# EAGLE design mbedWarp (EAGLE 7.7.0)

## Sheet 1 of 4
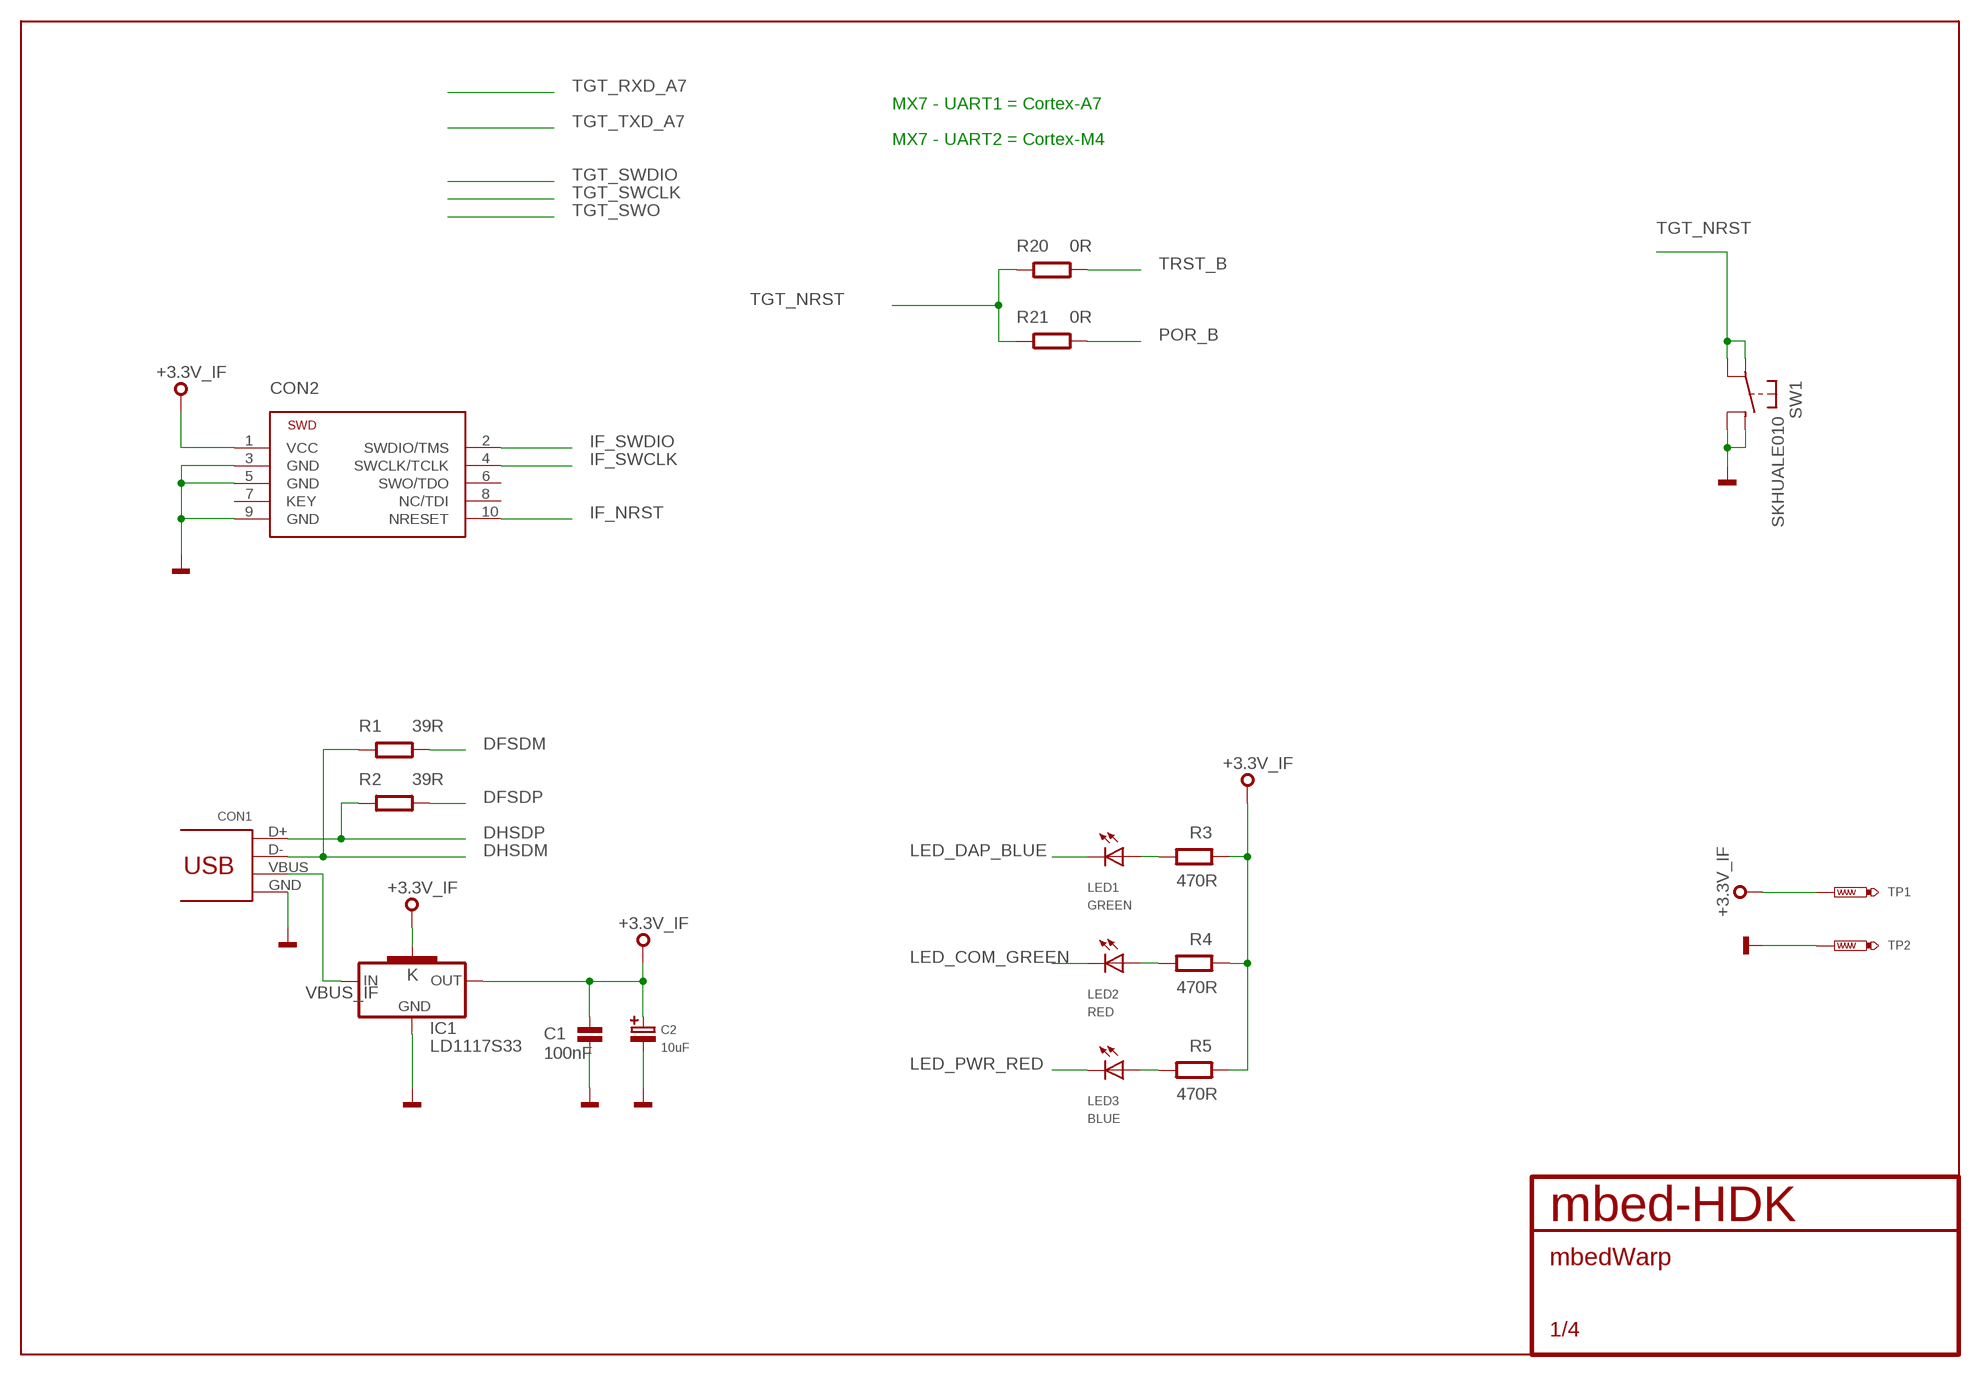
[diagram p0: schematic, sheet 1]

### Parts
C1  100nF  C0603  [0603]
C2  10uF  C-POL_B  [CASE-B]
CON1  USB_MICROB  [MOLEX-47364-0001]
CON2  SWD-10-SMD  [SWD-10-SMD]
IC1  LD1117S33  [SOT223]
LED1  GREEN  LED0603  [CHIPLED_0603]
LED2  RED  LED0603  [CHIPLED_0603]
LED3  BLUE  LED0603  [CHIPLED_0603]
R1  39R  R0603  [0603]
R2  39R  R0603  [0603]
R3  470R  R0603  [0603]
R4  470R  R0603  [0603]
R5  470R  R0603  [0603]
R20  0R  R0603  [0603]
R21  0R  R0603  [0603]
SW1  SKHUALE010  [SKHUALE010]
TP1  TEST-POINT-50R-PTH  [TP50-PTH]
TP2  TEST-POINT-50R-PTH  [TP50-PTH]

### Nets
+3.3V_IF: C1.1 C2.1 CON2.1(VCC) IC1.2(OUT) IC1.4(K) R3.1 R4.1 R5.1 TP1.TP ; also sheet 2,3,4
DFSDM: R1.2 ; also sheet 2
DFSDP: R2.2 ; also sheet 2
DHSDM: CON1.D- R1.1 ; also sheet 2
DHSDP: CON1.D+ R2.1 ; also sheet 2
GND: C1.2 C2.2 CON1.GND CON2.3(GND) CON2.5(GND) CON2.9(GND) IC1.1(GND) SW1.P$3(B1) SW1.P$4(B2) TP2.TP ; also sheet 2,3,4
IF_NRST: CON2.10(NRESET) ; also sheet 2
IF_SWCLK: CON2.4(SWCLK/TCLK) ; also sheet 2
IF_SWDIO: CON2.2(SWDIO/TMS) ; also sheet 2
LED_COM_GREEN: LED2.C ; also sheet 2
LED_DAP_BLUE: LED1.C ; also sheet 2
LED_PWR_RED: LED3.C ; also sheet 2
N$6: LED2.A R4.2
N$9: LED1.A R3.2
N$13: LED3.A R5.2
POR_B: R21.2 ; also sheet 4
TGT_NRST: R20.1 R21.1 SW1.P$1(A1) SW1.P$2(A2) ; also sheet 2
TRST_B: R20.2 ; also sheet 4
VBUS_IF: CON1.VBUS IC1.3(IN)
Unconnected: CON2.6(SWO/TDO) CON2.7(KEY) CON2.8(NC/TDI)

### Notes on the sheet
- MX7 - UART1 = Cortex-A7
- MX7 - UART2 = Cortex-M4

## Sheet 2 of 4
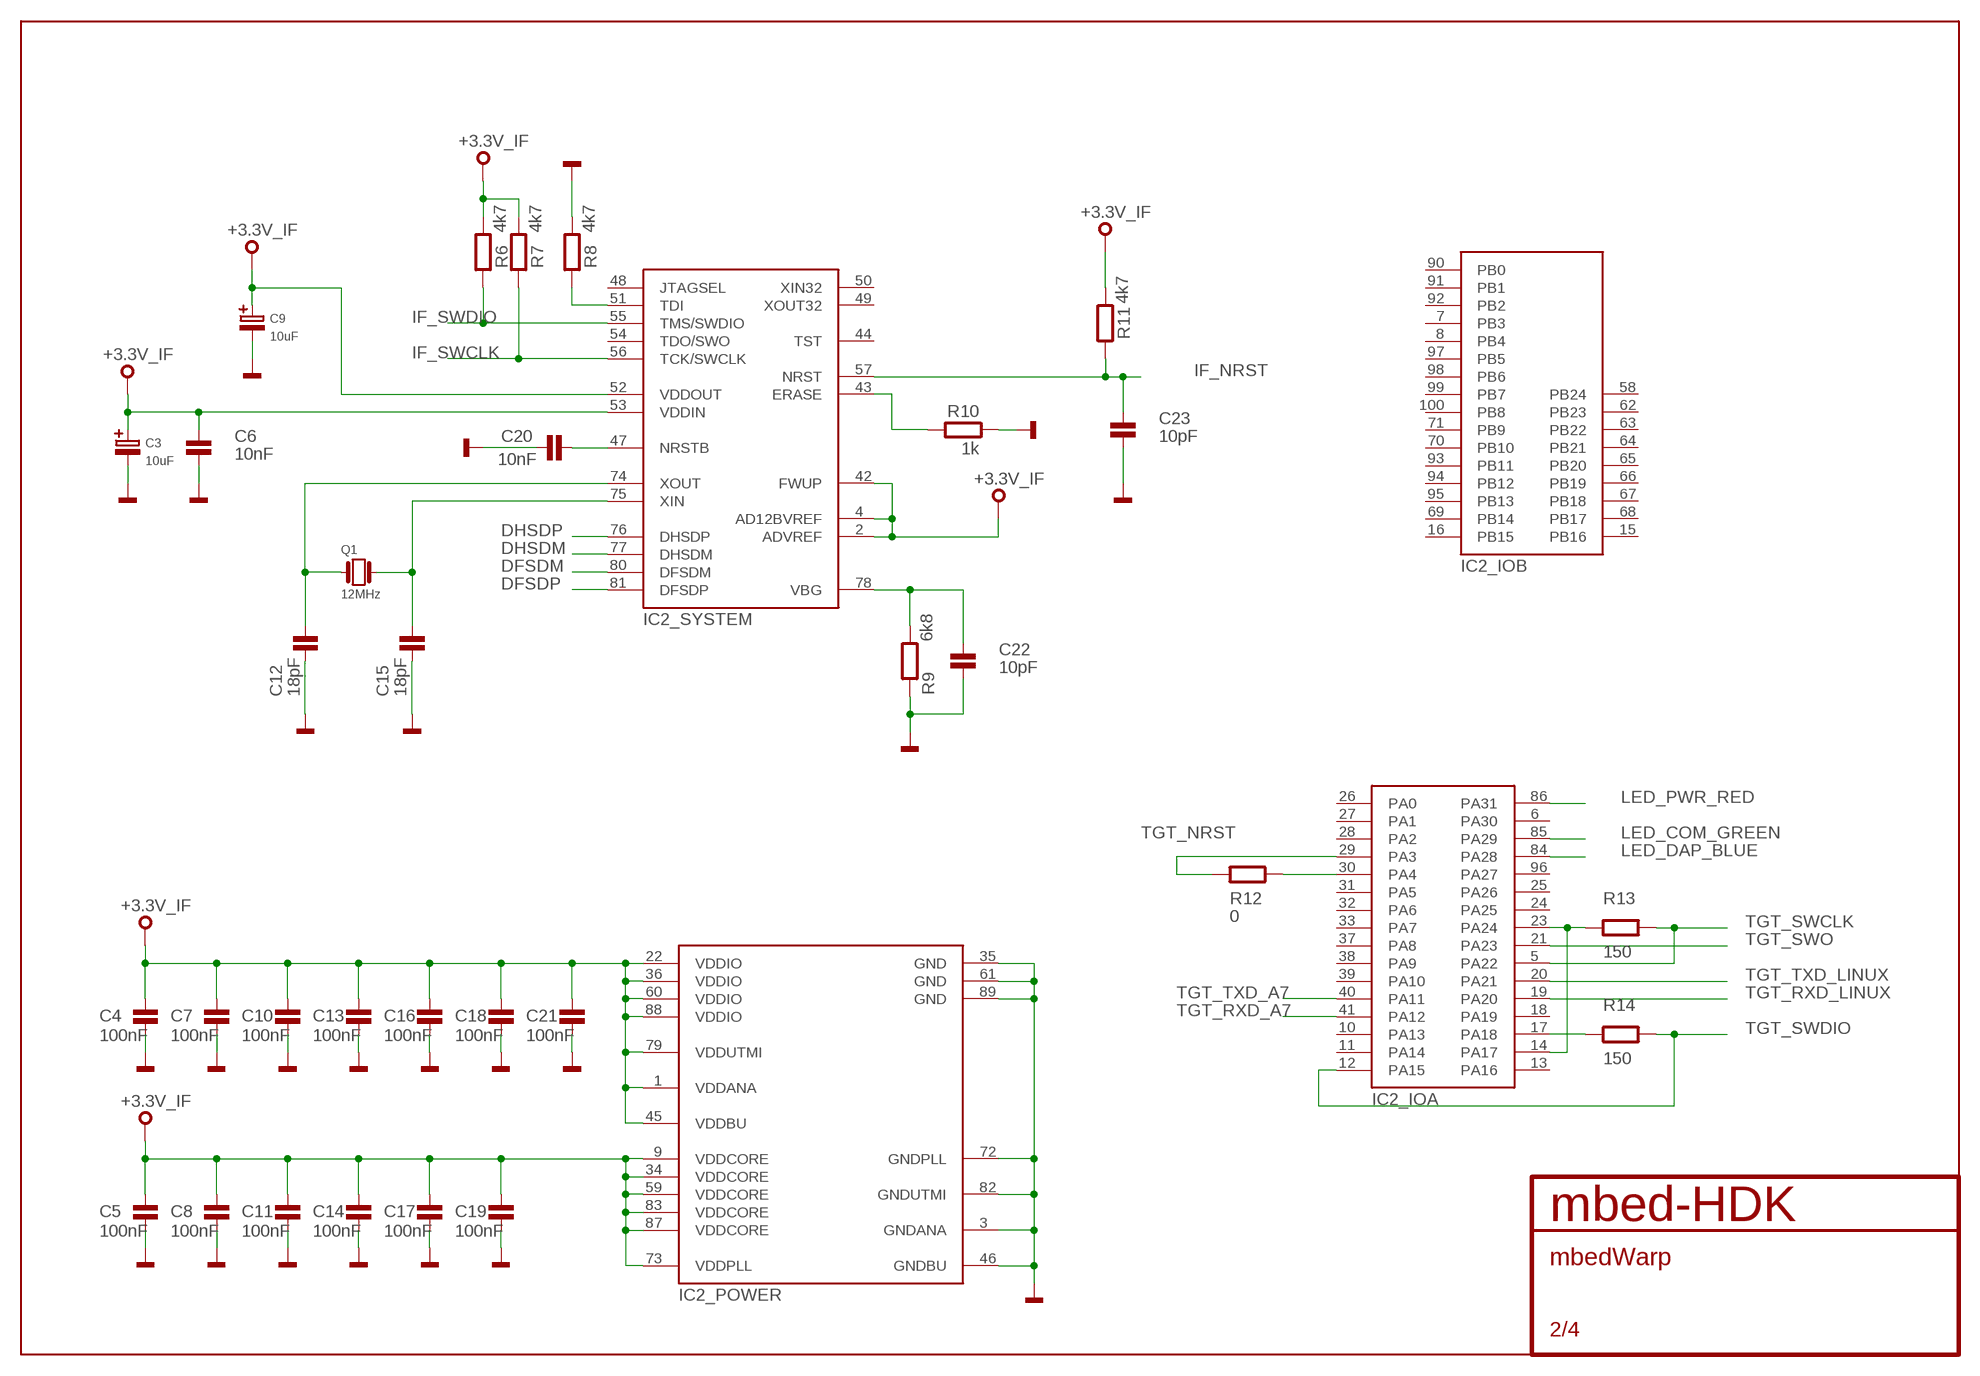
[diagram p1: schematic, sheet 2]

### Parts
C3  10uF  C-POL_B  [CASE-B]
C4  100nF  C0603  [0603]
C5  100nF  C0603  [0603]
C6  10nF  C0603  [0603]
C7  100nF  C0603  [0603]
C8  100nF  C0603  [0603]
C9  10uF  C-POL_B  [CASE-B]
C10  100nF  C0603  [0603]
C11  100nF  C0603  [0603]
C12  18pF  C0603  [0603]
C13  100nF  C0603  [0603]
C14  100nF  C0603  [0603]
C15  18pF  C0603  [0603]
C16  100nF  C0603  [0603]
C17  100nF  C0603  [0603]
C18  100nF  C0603  [0603]
C19  100nF  C0603  [0603]
C20  10nF  C0603  [0603]
C21  100nF  C0603  [0603]
C22  10pF  C0603  [0603]
C23  10pF  C0603  [0603]
IC2  AT91SAM3U2CA  [LQFP100]
Q1  12MHz  Q_3.2X2.5  [3.2X.2.5]
R6  4k7  R0603  [0603]
R7  4k7  R0603  [0603]
R8  4k7  R0603  [0603]
R9  6k8  R0603  [0603]
R10  1k  R0603  [0603]
R11  4k7  R0603  [0603]
R12  0  R0603  [0603]
R13  150  R0603  [0603]
R14  150  R0603  [0603]

### Nets
+3.3V_IF: C3.1 C4.1 C5.1 C6.1 C7.1 C8.1 C9.1 C10.1 C11.1 C13.1 C14.1 C16.1 C17.1 C18.1 C19.1 C21.1 IC2.1(_POWER:VDDANA) IC2.2(_SYSTEM:ADVREF) IC2.4(_SYSTEM:AD12BVREF) IC2.9(_POWER:VDDCORE) IC2.22(_POWER:VDDIO) IC2.34(_POWER:VDDCORE) IC2.36(_POWER:VDDIO) IC2.42(_SYSTEM:FWUP) IC2.45(_POWER:VDDBU) IC2.52(_SYSTEM:VDDOUT) IC2.53(_SYSTEM:VDDIN) IC2.59(_POWER:VDDCORE) IC2.60(_POWER:VDDIO) IC2.73(_POWER:VDDPLL) IC2.79(_POWER:VDDUTMI) IC2.83(_POWER:VDDCORE) IC2.87(_POWER:VDDCORE) IC2.88(_POWER:VDDIO) R6.2 R7.2 R11.2 ; also sheet 1,3,4
DFSDM: IC2.80(_SYSTEM:DFSDM) ; also sheet 1
DFSDP: IC2.81(_SYSTEM:DFSDP) ; also sheet 1
DHSDM: IC2.77(_SYSTEM:DHSDM) ; also sheet 1
DHSDP: IC2.76(_SYSTEM:DHSDP) ; also sheet 1
GND: C3.2 C4.2 C5.2 C6.2 C7.2 C8.2 C9.2 C10.2 C11.2 C12.2 C13.2 C14.2 C15.2 C16.2 C17.2 C18.2 C19.2 C20.2 C21.2 C22.2 C23.2 IC2.3(_POWER:GNDANA) IC2.35(_POWER:GND) IC2.46(_POWER:GNDBU) IC2.61(_POWER:GND) IC2.72(_POWER:GNDPLL) IC2.82(_POWER:GNDUTMI) IC2.89(_POWER:GND) R8.2 R9.1 R10.1 ; also sheet 1,3,4
IF_NRST: C23.1 IC2.57(_SYSTEM:NRST) R11.1 ; also sheet 1
IF_SWCLK: IC2.56(_SYSTEM:TCK/SWCLK) R7.1 ; also sheet 1
IF_SWDIO: IC2.55(_SYSTEM:TMS/SWDIO) R6.1 ; also sheet 1
LED_COM_GREEN: IC2.85(_IOA:PA29) ; also sheet 1
LED_DAP_BLUE: IC2.84(_IOA:PA28) ; also sheet 1
LED_PWR_RED: IC2.86(_IOA:PA31) ; also sheet 1
N$1: C12.1 IC2.74(_SYSTEM:XOUT) Q1.P$1
N$2: C15.1 IC2.75(_SYSTEM:XIN) Q1.P$3
N$3: C20.1 IC2.47(_SYSTEM:NRSTB)
N$4: IC2.51(_SYSTEM:TDI) R8.1
N$5: IC2.43(_SYSTEM:ERASE) R10.2
N$8: C22.1 IC2.78(_SYSTEM:VBG) R9.2
N$11: IC2.14(_IOA:PA17) IC2.23(_IOA:PA24) R13.1
N$12: IC2.17(_IOA:PA18) R14.1
N$14: IC2.30(_IOA:PA4) R12.2
TGT_NRST: IC2.29(_IOA:PA3) R12.1 ; also sheet 1
TGT_RXD_A7: IC2.41(_IOA:PA12) ; also sheet 1,4
TGT_RXD_LINUX: IC2.19(_IOA:PA20) ; also sheet 4
TGT_SWCLK: IC2.5(_IOA:PA22) R13.2 ; also sheet 1,4
TGT_SWDIO: IC2.12(_IOA:PA15) R14.2 ; also sheet 1,4
TGT_SWO: IC2.21(_IOA:PA23) ; also sheet 1,4
TGT_TXD_A7: IC2.40(_IOA:PA11) ; also sheet 1,4
TGT_TXD_LINUX: IC2.20(_IOA:PA21) ; also sheet 4
Unconnected: IC2.6(_IOA:PA30) IC2.7(_IOB:PB3) IC2.8(_IOB:PB4) IC2.10(_IOA:PA13) IC2.11(_IOA:PA14) IC2.13(_IOA:PA16) IC2.15(_IOB:PB16) IC2.16(_IOB:PB15) IC2.18(_IOA:PA19) IC2.24(_IOA:PA25) IC2.25(_IOA:PA26) IC2.26(_IOA:PA0) IC2.27(_IOA:PA1) IC2.28(_IOA:PA2) IC2.31(_IOA:PA5) IC2.32(_IOA:PA6) IC2.33(_IOA:PA7) IC2.37(_IOA:PA8) IC2.38(_IOA:PA9) IC2.39(_IOA:PA10) IC2.44(_SYSTEM:TST) IC2.48(_SYSTEM:JTAGSEL) IC2.49(_SYSTEM:XOUT32) IC2.50(_SYSTEM:XIN32) IC2.54(_SYSTEM:TDO/SWO) IC2.58(_IOB:PB24) IC2.62(_IOB:PB23) IC2.63(_IOB:PB22) IC2.64(_IOB:PB21) IC2.65(_IOB:PB20) IC2.66(_IOB:PB19) IC2.67(_IOB:PB18) IC2.68(_IOB:PB17) IC2.69(_IOB:PB14) IC2.70(_IOB:PB10) IC2.71(_IOB:PB9) IC2.90(_IOB:PB0) IC2.91(_IOB:PB1) IC2.92(_IOB:PB2) IC2.93(_IOB:PB11) IC2.94(_IOB:PB12) IC2.95(_IOB:PB13) IC2.96(_IOA:PA27) IC2.97(_IOB:PB5) IC2.98(_IOB:PB6) IC2.99(_IOB:PB7) IC2.100(_IOB:PB8)

## Sheet 3 of 4
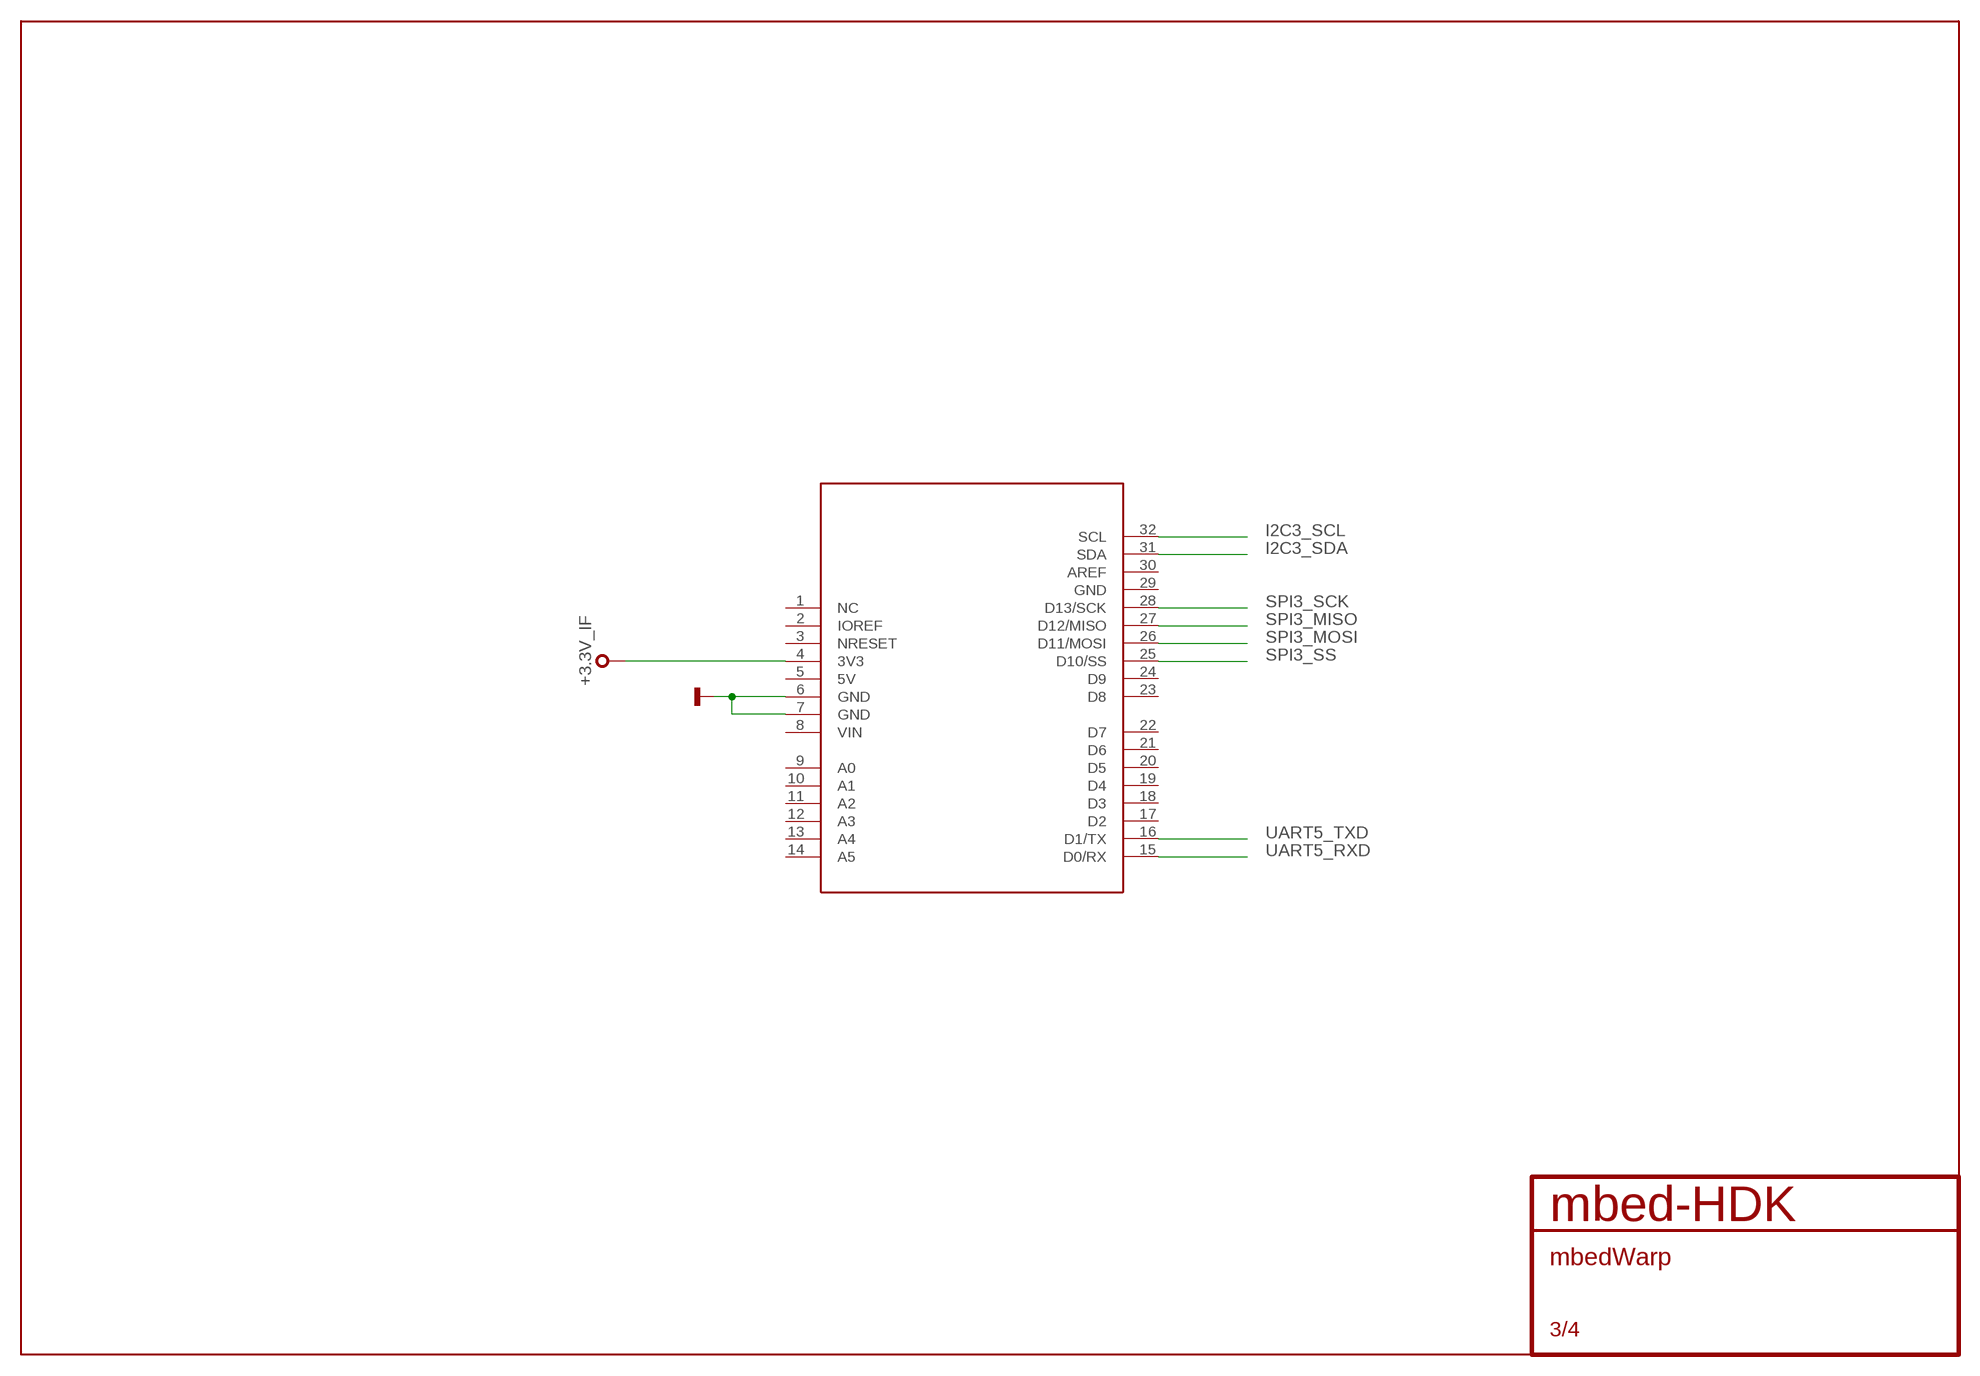
[diagram p2: schematic, sheet 3]

### Parts
BRD1  ARDUINO-R3_SILK  [ARDUINO-R3-SILK]

### Nets
+3.3V_IF: BRD1.4(3V3) ; also sheet 1,2,4
GND: BRD1.6(GND) BRD1.7(GND) ; also sheet 1,2,4
I2C3_SCL: BRD1.32(SCL) ; also sheet 4
I2C3_SDA: BRD1.31(SDA) ; also sheet 4
SPI3_MISO: BRD1.27(D12/MISO) ; also sheet 4
SPI3_MOSI: BRD1.26(D11/MOSI) ; also sheet 4
SPI3_SCK: BRD1.28(D13/SCK) ; also sheet 4
SPI3_SS: BRD1.25(D10/SS) ; also sheet 4
UART5_RXD: BRD1.15(D0/RX) ; also sheet 4
UART5_TXD: BRD1.16(D1/TX) ; also sheet 4
Unconnected: BRD1.1(NC) BRD1.2(IOREF) BRD1.3(NRESET) BRD1.5(5V) BRD1.8(VIN) BRD1.9(A0) BRD1.10(A1) BRD1.11(A2) BRD1.12(A3) BRD1.13(A4) BRD1.14(A5) BRD1.17(D2) BRD1.18(D3) BRD1.19(D4) BRD1.20(D5) BRD1.21(D6) BRD1.22(D7) BRD1.23(D8) BRD1.24(D9) BRD1.29(GND) BRD1.30(AREF)

## Sheet 4 of 4
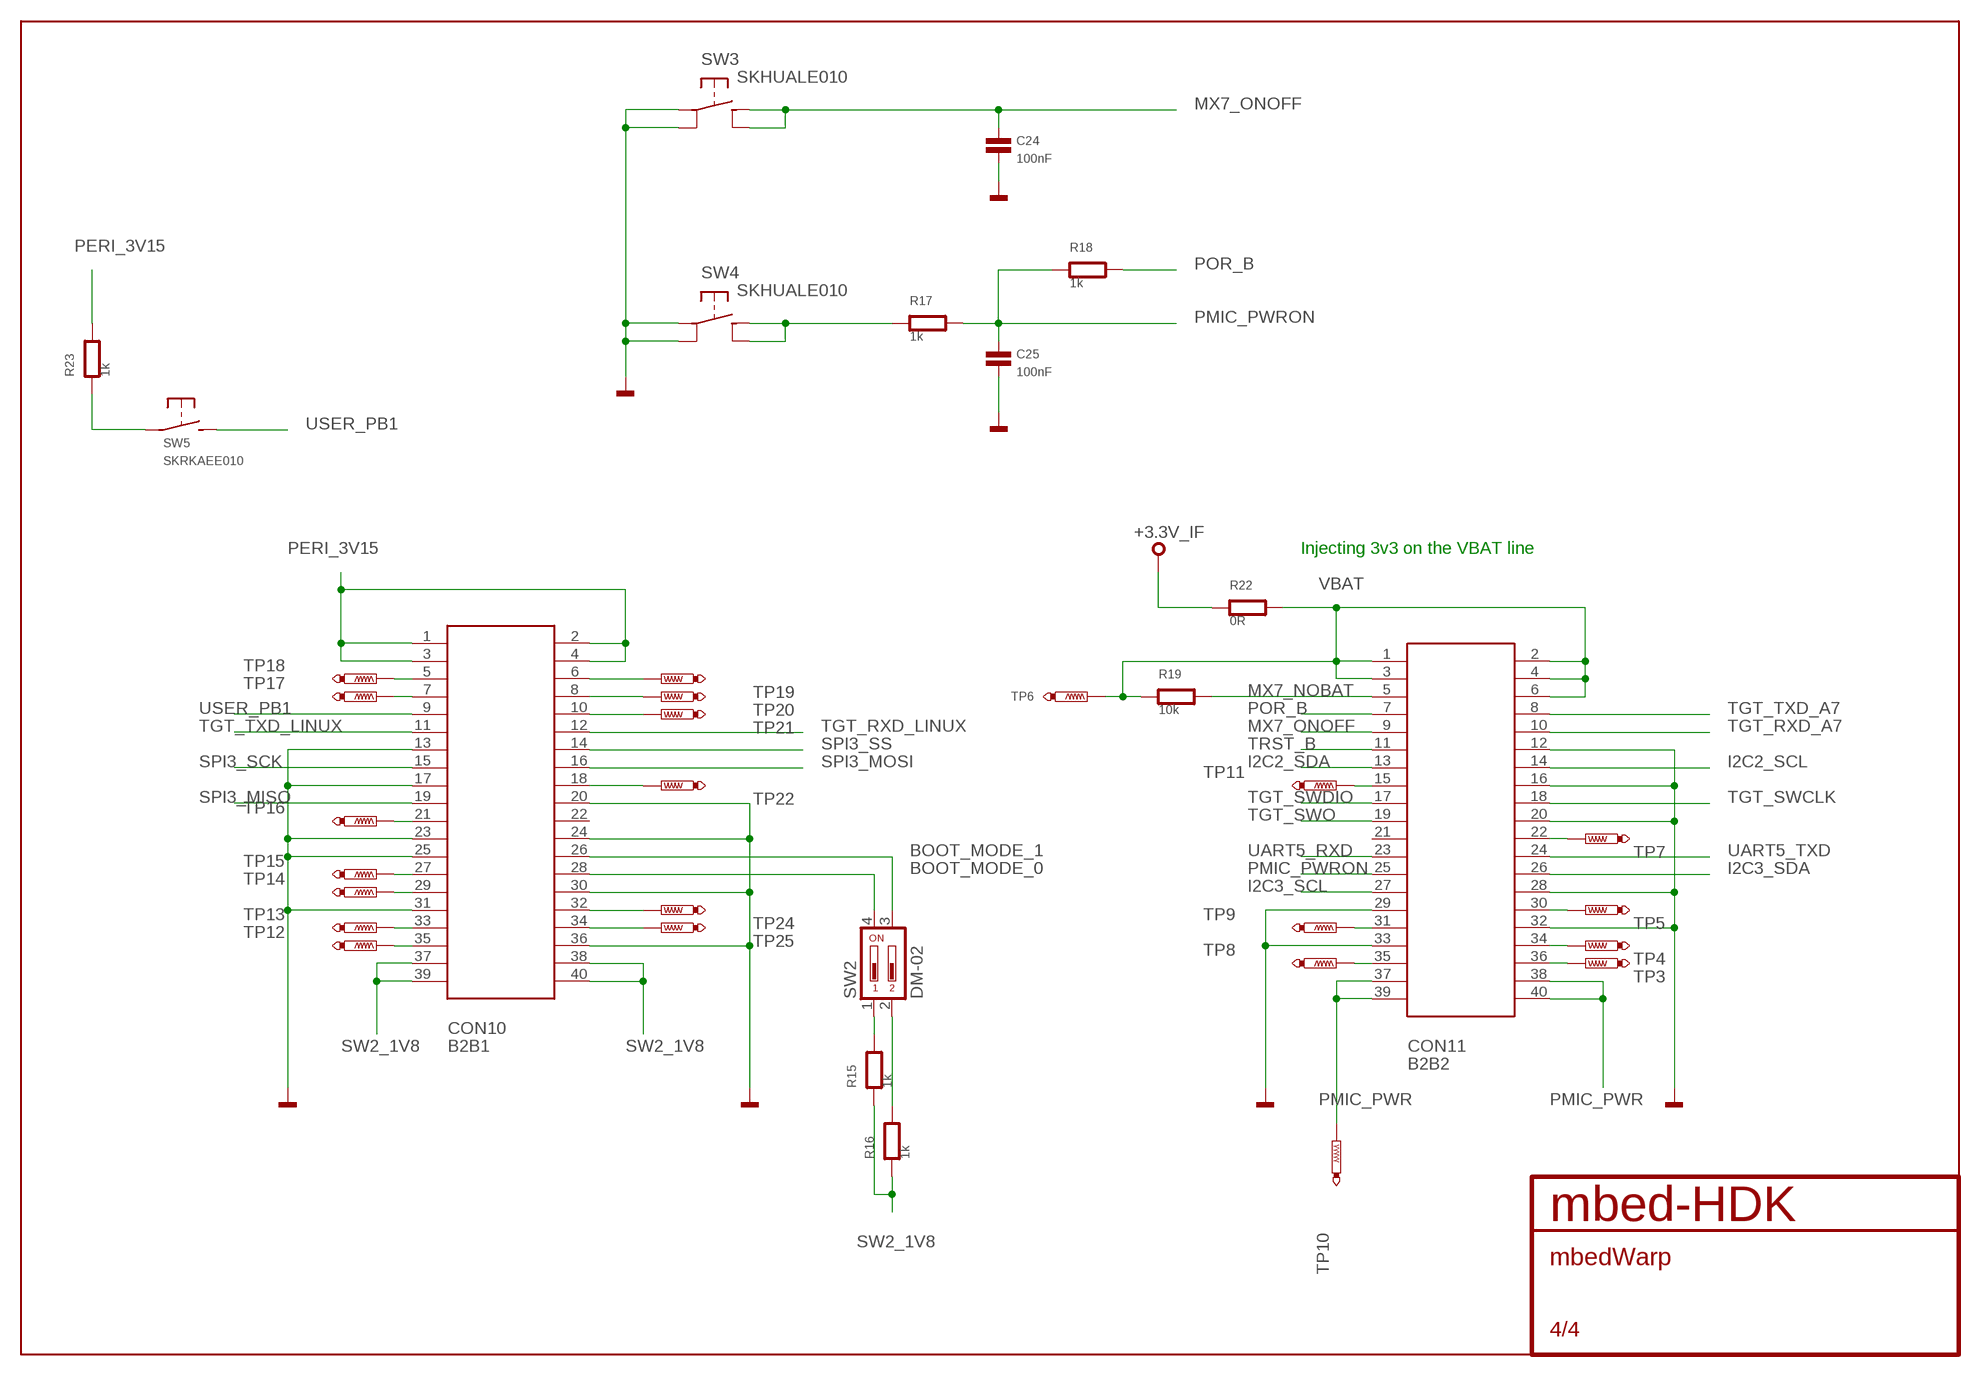
[diagram p3: schematic, sheet 4]

### Parts
C24  100nF  CAPACITOR0603  [0603]
C25  100nF  CAPACITOR0603  [0603]
CON10  B2B1  DF40HC-XX-40DS-XX-V  [DF40HC-XX-40DS-XX-V]
CON11  B2B2  DF40HC-XX-40DS-XX-V  [DF40HC-XX-40DS-XX-V]
R15  1k  RESISTOR0603  [0603]
R16  1k  RESISTOR0603  [0603]
R17  1k  RESISTOR0603  [0603]
R18  1k  RESISTOR0603  [0603]
R19  10k  RESISTOR0603  [0603]
R22  0R  RESISTOR0603  [0603]
R23  1k  RESISTOR0603  [0603]
SW2  DM-02  [DM-02]
SW3  SKHUALE010  [SKHUALE010]
SW4  SKHUALE010  [SKHUALE010]
SW5  SKRKAEE010  [SKRKAEE010]
TP3  PTR1TP06R  [TP06R]
TP4  PTR1TP06R  [TP06R]
TP5  PTR1TP06R  [TP06R]
TP6  TEST-POINT-50R-SMD  [TP50-SMD]
TP7  PTR1TP06R  [TP06R]
TP8  PTR1TP06R  [TP06R]
TP9  PTR1TP06R  [TP06R]
TP10  PTR1TP06R  [TP06R]
TP11  PTR1TP06R  [TP06R]
TP12  PTR1TP06R  [TP06R]
TP13  PTR1TP06R  [TP06R]
TP14  PTR1TP06R  [TP06R]
TP15  PTR1TP06R  [TP06R]
TP16  PTR1TP06R  [TP06R]
TP17  PTR1TP06R  [TP06R]
TP18  PTR1TP06R  [TP06R]
TP19  PTR1TP06R  [TP06R]
TP20  PTR1TP06R  [TP06R]
TP21  PTR1TP06R  [TP06R]
TP22  PTR1TP06R  [TP06R]
TP24  PTR1TP06R  [TP06R]
TP25  PTR1TP06R  [TP06R]

### Nets
+3.3V_IF: R22.1 ; also sheet 1,2,3
BOOT_MODE_0: CON10.28 SW2.4
BOOT_MODE_1: CON10.26 SW2.3
GND: C24.2 C25.2 CON10.13 CON10.17 CON10.20 CON10.23 CON10.24 CON10.25 CON10.30 CON10.31 CON10.36 CON11.12 CON11.16 CON11.20 CON11.28 CON11.29 CON11.32 CON11.33 SW3.P$1(A1) SW3.P$2(A2) SW4.P$1(A1) SW4.P$2(A2) ; also sheet 1,2,3
I2C2_SCL: CON11.14
I2C2_SDA: CON11.13
I2C3_SCL: CON11.27 ; also sheet 3
I2C3_SDA: CON11.26 ; also sheet 3
MX7_NOBAT: CON11.5 R19.2
MX7_ONOFF: C24.1 CON11.9 SW3.P$3(B1) SW3.P$4(B2)
N$7: R17.1 SW4.P$3(B1) SW4.P$4(B2)
N$10: R23.1 SW5.P$1(P)
N$15: CON11.36 TP3.TP
N$16: CON11.22 TP7.TP
N$17: CON11.30 TP5.TP
N$18: CON11.34 TP4.TP
N$19: CON11.15 TP11.TP
N$20: R15.2 SW2.1
N$21: R16.2 SW2.2
N$23: CON11.31 TP9.TP
N$24: CON11.35 TP8.TP
N$25: CON10.5 TP18.TP
N$26: CON10.7 TP17.TP
N$27: CON10.21 TP16.TP
N$28: CON10.27 TP15.TP
N$29: CON10.29 TP14.TP
N$30: CON10.33 TP13.TP
N$31: CON10.35 TP12.TP
N$32: CON10.34 TP25.TP
N$33: CON10.32 TP24.TP
N$35: CON10.18 TP22.TP
N$36: CON10.10 TP21.TP
N$37: CON10.8 TP20.TP
N$38: CON10.6 TP19.TP
PERI_3V15: CON10.1 CON10.2 CON10.3 CON10.4 R23.2
PMIC_PWR: CON11.37 CON11.38 CON11.39 CON11.40 TP10.TP
PMIC_PWRON: C25.1 CON11.25 R17.2 R18.1
POR_B: CON11.7 R18.2 ; also sheet 1
SPI3_MISO: CON10.19 ; also sheet 3
SPI3_MOSI: CON10.16 ; also sheet 3
SPI3_SCK: CON10.15 ; also sheet 3
SPI3_SS: CON10.14 ; also sheet 3
SW2_1V8: CON10.37 CON10.38 CON10.39 CON10.40 R15.1 R16.1
TGT_RXD_A7: CON11.10 ; also sheet 1,2
TGT_RXD_LINUX: CON10.12 ; also sheet 2
TGT_SWCLK: CON11.18 ; also sheet 1,2
TGT_SWDIO: CON11.17 ; also sheet 1,2
TGT_SWO: CON11.19 ; also sheet 1,2
TGT_TXD_A7: CON11.8 ; also sheet 1,2
TGT_TXD_LINUX: CON10.11 ; also sheet 2
TRST_B: CON11.11 ; also sheet 1
UART5_RXD: CON11.23 ; also sheet 3
UART5_TXD: CON11.24 ; also sheet 3
USER_PB1: CON10.9 SW5.P$2(S)
VBAT: CON11.1 CON11.2 CON11.3 CON11.4 CON11.6 R19.1 R22.2 TP6.TP
Unconnected: CON10.22 CON11.21

### Notes on the sheet
- Injecting 3v3 on the VBAT line

## Library data of the parts
BRD1 = mbed-HDK-misc-Board:ARDUINO-R3: Shield for Arduino R3
C1 C4-C8 C10-C23 = mbed-HDK:C: Capacitor
C2 C3 C9 = mbed-HDK:C-POL: Polarised capacitor
C24 C25 = mbed-HDK-RLC:CAPACITOR: Capacitor
CON1 = mbed-HDK:USB: USB Connectors
CON2 = mbed-HDK-Connector:SWD-10: 2.54mm pitch 10-Pin Cortex Programming Header
CON10 CON11 = Treadstone:DF40HC-XX-40DS-XX-V
IC1 = mbed-HDK:LD1117S33: VOLTAGE REGULATOR SMD 3,3V
IC2 = mbed-HDK:AT91SAM3U2CA
LED1-LED3 = mbed-HDK:LED: SMD LED
Q1 = mbed-HDK:Q
R1-R14 R20 R21 = mbed-HDK:R
R15-R19 R22 R23 = mbed-HDK-RLC:RESISTOR: Resistor
SW1 SW3 SW4 = mbed-HDK-Switch:SKHUALE010: MOMENTARY SWITCH PUSH VERTICAL (4-SPST); MF: ALPS; MFN: SKHUALE010; OC-MOUSER: 688-SKHUALE010
SW2 = LabBoard:DM-02
SW5 = mbed-HDK-Switch:SKRKAEE010: MOMENTARY SWITCH PUSH VERTICAL (SPST); MF: ALPS; MFN: SKRKAEE010; OC-MOUSER: 688-SKRKAE
TP1 TP2 TP6 = mbed-HDK:TEST-POINT
TP3-TP5 TP7-TP22 TP24 TP25 = testpad:PTR1: TEST PIN

## Board
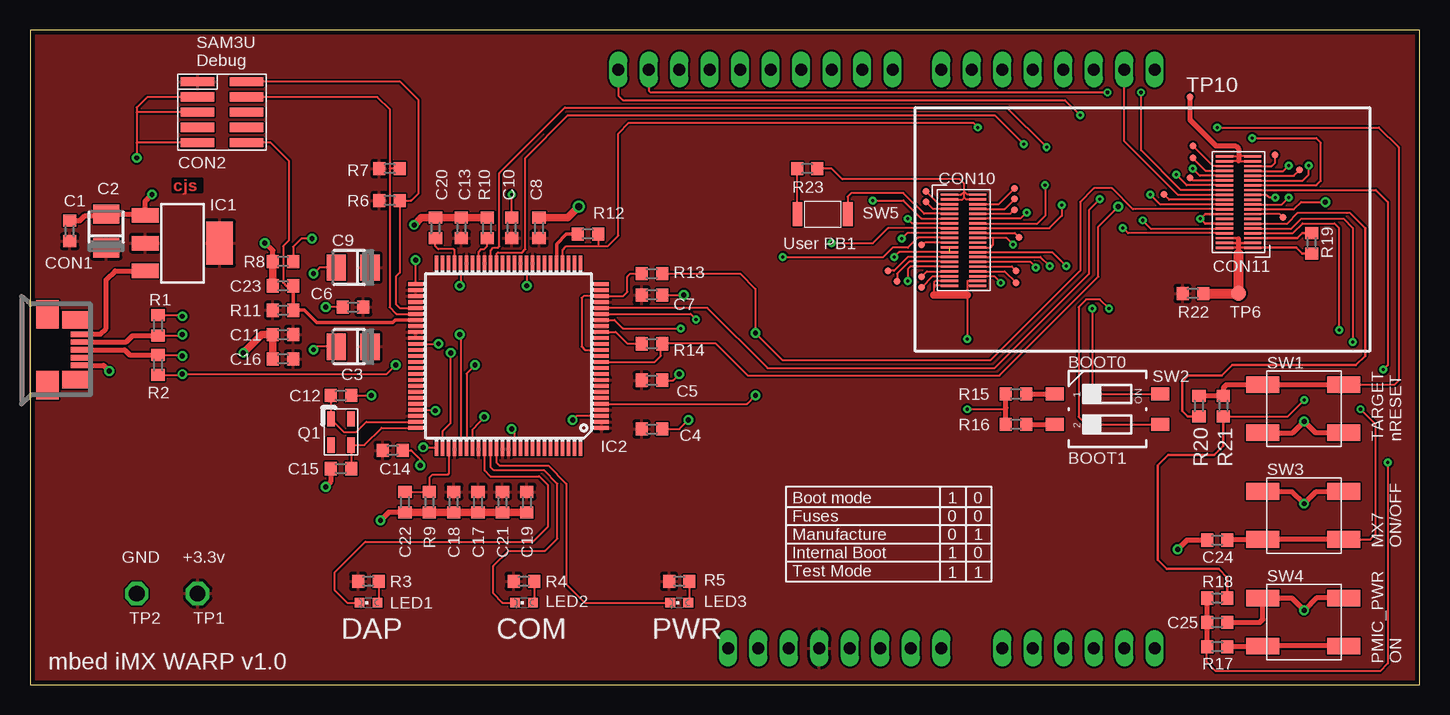
[diagram p4: board, top side]
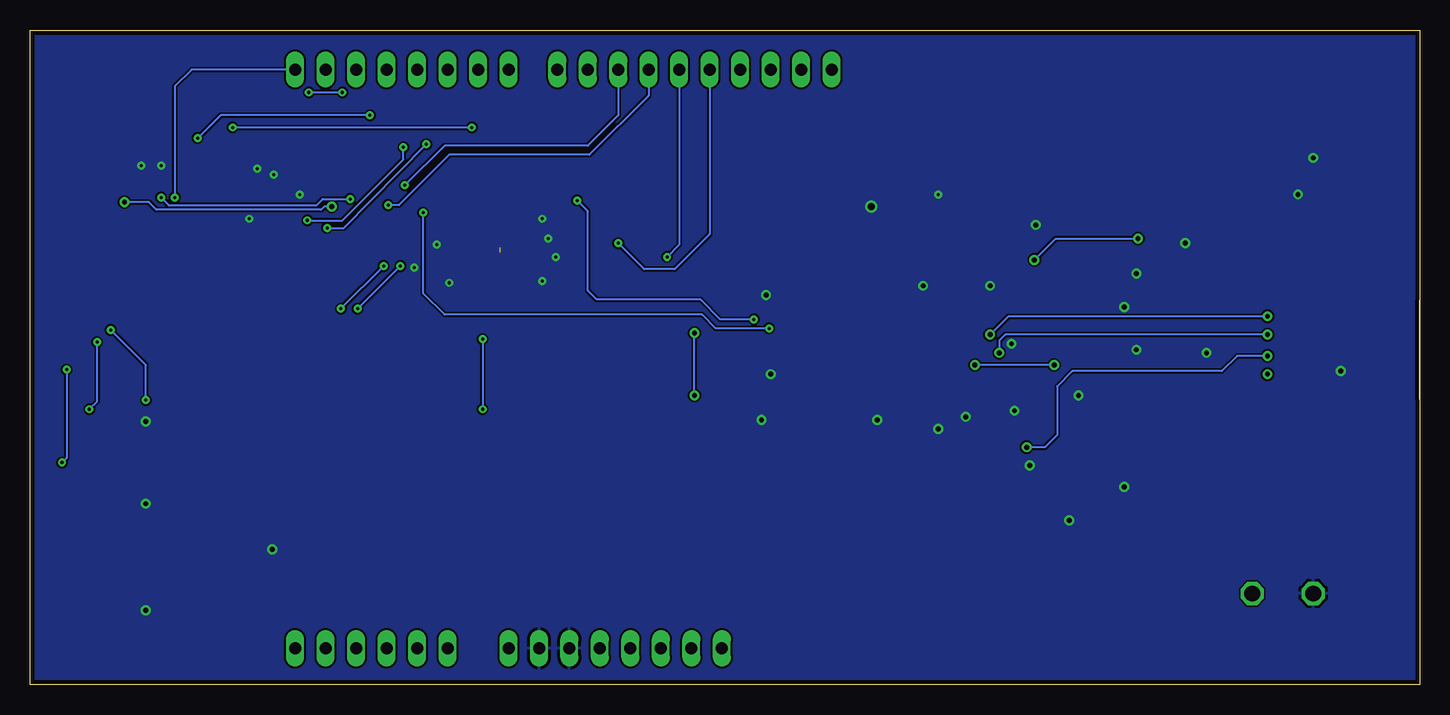
[diagram p5: board, bottom side, seen from below]

Size 115.83 x 54.61 mm. Coordinates in mm from the lower left corner, seen from the top.
Outline: 0,54.61 0,0 115.83,0 115.83,54.61 0,54.61
Copper layers ((1*16)): Top 0.035mm / dielectric 0.8mm / Bottom 0.035mm
Design rules "mbed-HDK-6-6-2-layer": minimum track width 6mil, minimum drill 9mil, track to track 6mil, track to pad 6mil, pad to pad 6mil, via to via 6mil, smd to smd 6mil, copper to edge 15mil, drill to drill 8mil, minimum pad ring 10mil, minimum via ring 8mil, stop-mask expansion 4mil, vias tented up to drill 0mil, thermal gap 10mil

### Footprints (pad centres in the part's own frame; a part is rotated, then mirrored left to right if it is on the bottom)
ARDUINO-R3-SILK = drill 1 long: 1 27.94,2.54; 2 30.48,2.54; 3 33.02,2.54; 4 35.56,2.54; 5 38.1,2.54; 6 40.64,2.54; 7 43.18,2.54; 8 45.72,2.54; 9 50.8,2.54; 10 53.34,2.54; 11 55.88,2.54; 12 58.42,2.54; 13 60.96,2.54; 14 63.5,2.54; 15 63.5,50.8; 16 60.96,50.8; 17 58.42,50.8; 18 55.88,50.8; 19 53.34,50.8; 20 50.8,50.8; 21 48.26,50.8; 22 45.72,50.8; 23 41.656,50.8; 24 39.116,50.8; 25 36.576,50.8; 26 34.036,50.8; 27 31.496,50.8; 28 28.956,50.8; 29 26.416,50.8; 30 23.876,50.8; 31 21.336,50.8; 32 18.796,50.8
0603 = smd 1 x 1.1: 1 -0.85,0; 2 0.85,0
CASE-B = smd 1.6 x 2.2: 1 -1.4,0; 2 1.4,0
MOLEX-47364-0001 = smd 1.7 x 0.45: 4 2.8,-0.65; D+ 2.8,0; D- 2.8,0.65; GND 2.8,-1.3; VBUS 2.8,1.3 | smd 1.9 x 2.375: GND1 0,2.95; GND4 0,-2.95 | smd 2.1 x 1.475: GND2 2.3,2.5; GND3 2.3,-2.5
SWD-10-SMD = smd 0.762 x 2.794: 1 0.381,-2.032; 2 0.381,2.032; 3 1.651,-2.032; 4 1.651,2.032; 5 2.921,-2.032; 6 2.921,2.032; 7 4.191,-2.032; 8 4.191,2.032; 9 5.461,-2.032; 10 5.461,2.032
DF40HC-XX-40DS-XX-V = smd 0.2 x 1.43: 1 -3.8,-1.175; 2 -3.8,1.175; 3 -3.4,-1.175; 4 -3.4,1.175; 5 -3,-1.175; 6 -3,1.175; 7 -2.6,-1.175; 8 -2.6,1.175; 9 -2.2,-1.175; 10 -2.2,1.175; 11 -1.8,-1.175; 12 -1.8,1.175; 13 -1.4,-1.175; 14 -1.4,1.175; 15 -1,-1.175; 16 -1,1.175; 17 -0.6,-1.175; 18 -0.6,1.175; 19 -0.2,-1.175; 20 -0.2,1.175; 21 0.2,-1.175; 22 0.2,1.175; 23 0.6,-1.175; 24 0.6,1.175; 25 1,-1.175; 26 1,1.175; 27 1.4,-1.175; 28 1.4,1.175; 29 1.8,-1.175; 30 1.8,1.175; 31 2.2,-1.175; 32 2.2,1.175; 33 2.6,-1.175; 34 2.6,1.175; 35 3,-1.175; 36 3,1.175; 37 3.4,-1.175; 38 3.4,1.175; 39 3.8,-1.175; 40 3.8,1.175
SOT223 = smd 1.219 x 2.235: 1 -2.311,-3.099; 2 0,-3.099; 3 2.311,-3.099 | smd 3.6 x 2.2: 4 0,3.099
LQFP100 = smd 1.2 x 0.32: 1 -7.75,6; 2 -7.75,5.5; 3 -7.75,5; 4 -7.75,4.5; 5 -7.75,4; 6 -7.75,3.5; 7 -7.75,3; 8 -7.75,2.5; 9 -7.75,2; 10 -7.75,1.5; 11 -7.75,1; 12 -7.75,0.5; 13 -7.75,0; 14 -7.75,-0.5; 15 -7.75,-1; 16 -7.75,-1.5; 17 -7.75,-2; 18 -7.75,-2.5; 19 -7.75,-3; 20 -7.75,-3.5; 21 -7.75,-4; 22 -7.75,-4.5; 23 -7.75,-5; 24 -7.75,-5.5; 25 -7.75,-6; 51 7.75,-6; 52 7.75,-5.5; 53 7.75,-5; 54 7.75,-4.5; 55 7.75,-4; 56 7.75,-3.5; 57 7.75,-3; 58 7.75,-2.5; 59 7.75,-2; 60 7.75,-1.5; 61 7.75,-1; 62 7.75,-0.5; 63 7.75,0; 64 7.75,0.5; 65 7.75,1; 66 7.75,1.5; 67 7.75,2; 68 7.75,2.5; 69 7.75,3; 70 7.75,3.5; 71 7.75,4; 72 7.75,4.5; 73 7.75,5; 74 7.75,5.5; 75 7.75,6 | smd 0.32 x 1.2: 26 -6,-7.75; 27 -5.5,-7.75; 28 -5,-7.75; 29 -4.5,-7.75; 30 -4,-7.75; 31 -3.5,-7.75; 32 -3,-7.75; 33 -2.5,-7.75; 34 -2,-7.75; 35 -1.5,-7.75; 36 -1,-7.75; 37 -0.5,-7.75; 38 0,-7.75; 39 0.5,-7.75; 40 1,-7.75; 41 1.5,-7.75; 42 2,-7.75; 43 2.5,-7.75; 44 3,-7.75; 45 3.5,-7.75; 46 4,-7.75; 47 4.5,-7.75; 48 5,-7.75; 49 5.5,-7.75; 50 6,-7.75; 76 6,7.75; 77 5.5,7.75; 78 5,7.75; 79 4.5,7.75; 80 4,7.75; 81 3.5,7.75; 82 3,7.75; 83 2.5,7.75; 84 2,7.75; 85 1.5,7.75; 86 1,7.75; 87 0.5,7.75; 88 0,7.75; 89 -0.5,7.75; 90 -1,7.75; 91 -1.5,7.75; 92 -2,7.75; 93 -2.5,7.75; 94 -3,7.75; 95 -3.5,7.75; 96 -4,7.75; 97 -4.5,7.75; 98 -5,7.75; 99 -5.5,7.75; 100 -6,7.75
CHIPLED_0603 = smd 0.8 x 0.8: A 0,-0.75; C 0,0.75
3.2X.2.5 = smd 1.27 x 0.635: P$1 -1.092,-0.838; P$2 1.092,-0.838; P$3 1.092,0.838; P$4 -1.092,0.838
SKHUALE010 = smd 2.75 x 1.4: P$1 0,0; P$2 6.75,0; P$3 0,-4; P$4 6.75,-4
DM-02 = smd 1.1 x 1.5: 1 -1.27,-4.4; 2 1.27,-4.4; 3 1.27,4.4; 4 -1.27,4.4
SKRKAEE010 = smd 0.8 x 2: P$1 -2.1,0; P$2 2.1,0
TP50-PTH = drill 1.3 octagon: TP 0,0
TP06R = smd 0.6 x 0.6: TP 0,0
TP50-SMD = smd 1.27 x 1.27: TP 0,0

### Placement (x,y rotation side)
BRD1  30.23,0.51 0 top
C1  3.3,37.85 90 top
C2  6.35,37.85 90 top
C3  26.93,28.19 180 top
C4  51.82,21.34 0 top
C5  51.82,25.4 0 top
C6  26.93,31.5 180 top
C7  51.82,32.51 0 top
C8  42.42,38.1 90 top
C9  26.93,34.8 180 top
C10  40.13,38.1 90 top
C11  21.08,29.21 180 top
C12  25.91,24.13 0 top
C13  35.94,38.1 90 top
C14  30.23,19.56 0 top
C15  25.91,18.03 180 top
C16  21.08,27.18 180 top
C17  37.34,15.24 270 top
C18  35.31,15.24 270 top
C19  39.37,15.24 270 top
C20  33.78,38.1 90 top
C21  41.4,15.24 270 top
C22  31.24,15.24 270 top
C23  21.08,33.27 180 top
C24  98.94,12.07 180 top
C25  98.94,5.21 0 top
CON1  1.45,27.94 0 top
CON2  16,50.67 270 top
CON10  77.8,37.08 270 top
CON11  100.71,40.26 90 top
IC1  12.7,36.83 270 top
IC2  39.88,27.43 180 top
LED1  28.2,6.86 90 top
LED2  41.15,6.86 90 top
LED3  54.1,6.86 90 top
Q1  25.91,21.08 270 top
R1  10.67,29.97 90 top
R2  10.67,26.67 270 top
R3  28.2,8.64 0 top
R4  41.15,8.64 0 top
R5  54.1,8.64 0 top
R6  29.97,40.39 180 top
R7  29.97,43.05 180 top
R8  21.08,35.31 180 top
R9  33.28,15.24 90 top
R10  38.1,38.1 270 top
R11  21.08,31.24 180 top
R12  46.48,37.59 180 top
R13  51.82,34.29 0 top
R14  51.82,28.45 0 top
R15  82.17,24.26 0 top
R16  82.17,21.72 0 top
R17  98.94,3.17 180 top
R18  98.94,7.24 0 top
R19  106.81,36.83 90 top
R20  97.41,23.24 270 top
R21  99.44,23.24 270 top
R22  96.9,32.64 0 top
R23  64.77,43.05 0 top
SW1  102.75,25.02 0 top
SW2  89.79,22.99 270 top
SW3  102.75,16.13 0 top
SW4  102.75,7.24 0 top
SW5  66.04,39.24 0 top
TP1  13.97,7.62 0 top
TP2  8.89,7.62 0 top
TP3  96.9,44.96 0 top
TP4  96.9,43.94 0 top
TP5  96.65,42.29 0 top
TP6  100.71,32.64 0 top
TP7  94.49,40.89 0 top
TP8  103.76,44.2 0 top
TP9  105.79,42.93 0 top
TP10  96.65,49.02 0 top
TP11  104.4,38.99 0 top
TP12  74.3,33.15 90 top
TP13  74.3,34.04 90 top
TP14  72.27,33.66 90 top
TP15  71.5,34.54 90 top
TP16  74.3,36.7 90 top
TP17  74.68,40.26 90 top
TP18  74.68,41.15 90 top
TP19  82.04,41.4 90 top
TP20  82.04,40.51 90 top
TP21  82.04,39.62 90 top
TP22  82.43,37.34 90 top
TP24  82.17,34.54 90 top
TP25  82.17,33.53 90 top

### Tracks (layer width: path | path; a pad name or v marks a point on that pad's centre or on a via)
+3.3V_IF
  pour Top: -1.27,-1.27 116.84,-1.27 116.84,55.88 -1.27,55.88
BOOT_MODE_0  (via drill 0.25)
  Top 0.152: CON10.28 84.21,35.68 v84.97,34.92 | v88.52,31.37 88.52,25.02 89.28,24.26 SW2.4
  Bottom 0.152: v84.97,34.92 v88.52,31.37
BOOT_MODE_1  (via drill 0.25)
  Top 0.152: CON10.26 85.2,36.08 v86.36,34.92 | v89.92,31.37 89.16,32.13 88.01,32.13 87.38,31.5 87.38,22.35 88.01,21.72 SW2.3
  Bottom 0.152: v86.36,34.92 v89.92,31.37
DFSDM  (via drill 0.41)
  Top 0.152: R1.2 12.61,30.82 v12.7,30.73 | v35.82,29.21 35.88,29.15 IC2.80
  Bottom 0.152: v12.7,30.73 34.29,30.73 v35.82,29.21
DFSDP  (via drill 0.41)
  Top 0.152: R2.2 12.61,25.82 v12.7,25.91 29.72,25.91 v30.48,26.67 | v37.09,26.67 36.38,25.96 IC2.81
  Bottom 0.152: v30.48,26.67 v37.09,26.67
DHSDM  (via drill 0.41)
  Top 0.152: R1.1 12.61,29.12 v12.7,29.21 | IC2.77 34.38,21.17 35.05,21.84 v35.05,27.69
  Top 0.406: CON1.D- 8.02,28.59 8.55,29.12 R1.1
  Bottom 0.152: v12.7,29.21 34.55,29.21 35.05,28.7 v35.05,27.69
DHSDP  (via drill 0.41)
  Top 0.152: R2.1 12.61,27.52 v12.7,27.43 | v32.77,19.81 33.75,19.81 IC2.76
  Top 0.305: 10.58,27.43 R2.1
  Top 0.406: CON1.D+ 7.88,27.94 8.3,27.52 R2.1
  Bottom 0.152: v12.7,27.43 15.24,27.43 16.51,26.16 28.96,26.16 30.23,24.89 30.23,20.83 31.24,19.81 v32.77,19.81
GND  (via drill 0.25, 0.41, 0.6)  (1 unrouted)
  Top 0.152: C12.2 v28.45,24.13 | IC2.72 33.71,22.93 v33.78,22.86 | IC2.82 36.88,21.29 v37.85,22.35 | IC2.89 40.38,21.09 v40.13,21.34 | IC2.3 45.55,22.43 v45.21,22.1 | IC2.61 34.02,28.43 v34.04,28.45 | IC2.46 35.88,33.34 v35.82,33.27 | IC2.35 41.38,33.3 v41.4,33.27 | C3.2 23.88,28.19 v23.62,27.94 | C6.2 v24.64,31.5 | C4.2 54.1,21.34 v54.87,22.1 | C5.2 53.6,25.4 v54.1,25.91 | C7.2 v54.49,32.51 | C9.2 24.13,34.8 v23.62,34.29 | C14.2 31.75,19.56 32.51,18.8 v32.51,18.29 | CON2.3 9.78,49.02 8.89,48.13 8.89,47.75 | 8.89,47.75 8.89,45.21 | 8.89,45.21 v8.89,43.94 | CON2.9 8.89,45.21 | CON2.5 8.89,47.75 | CON10.13 73.54,38.48 v73.15,38.86 | CON10.17 73.12,37.68 v72.65,37.21 | CON10.31 73.37,34.88 73.15,34.67 v73.15,33.66 | CON10.36 80.35,34.08 v80.9,33.53 | CON10.20 80.27,37.28 | 80.27,37.28 81.34,37.28 v81.92,36.7 | CON10.24 80.05,36.48 80.27,36.7 80.27,37.28 | CON10.30 83.34,35.28 v83.82,34.8 | CON11.33 104.46,42.86 v104.9,43.31 | CON11.29 106.07,42.06 106.56,42.55 v106.56,43.31 | CON11.32 97.5,42.46 v96.9,43.05 | CON11.28 96.39,41.66 v95.51,42.55 | CON11.20 94.18,40.06 v93.35,40.89 | CON11.16 99.55,39.24 | CON10.25 72.41,36.08 v72.01,35.69 | C10.2 v40.13,40.89
  Top 0.203: CON11.12 97.94,38.46 v97.54,38.86 97.94,39.26 CON11.16
  Top 0.406: C22.2 29.89,14.39 v29.21,13.72 | C15.2 25.06,16.93 v24.64,16.51 | R8.2 20.23,36.23 v19.56,36.83 | C1.2 4.15,38.7 4.57,39.12 6.22,39.12 C2.2 9.5,39.25 IC1.1 9.6,40.34 v10.16,40.89 | CON1.GND 6.13,26.64 v6.61,26.16 | SW4.P$2 107.19,7.24 v106.17,6.22 105.16,7.24 SW4.P$1 102.75,5.46 102.49,5.21 C25.2 | C24.2 96.4,12.07 v95.63,11.3 | SW3.P$1 105.16,16.13 v106.17,15.11 107.19,16.13 SW3.P$2 | SW1.P$3 105.22,21.02 v106.17,21.97 107.13,21.02 SW1.P$4
  Top 0.61: C22.2 R9.1 C18.2 C17.2 C19.2 C21.2 | R8.2 C23.2 | C16.2 C11.2 19.31,29.21 v17.78,27.69 | R10.1 C13.2 C20.2 32.6,38.95 v32.01,38.35 | C8.2 44.79,38.95 v45.72,39.88
  pour Bottom: -1.27,-1.27 116.84,-1.27 116.84,55.88 -1.27,55.88
I2C3_SCL  (via drill 0.25)
  Top 0.152: CON11.27 107.19,41.66 107.57,42.04 107.57,45.21 107.19,45.59 v101.86,45.59 | BRD1.32 49.02,49.15 49.41,48.77 86.24,48.77 v87.51,47.5
  Bottom 0.152: v87.51,47.5 99.95,47.5 v101.86,45.59
I2C3_SDA  (via drill 0.25)
  Top 0.152: CON11.26 95.9,41.26 92.59,44.58 v92.59,49.4 | BRD1.31 51.56,49.53 51.69,49.4 v89.79,49.4
  Bottom 0.152: v92.59,49.4 v89.79,49.4
IF_NRST
  Top 0.152: C23.1 21.34,33.27 21.08,33.53 21.08,36.58 21.59,37.08 21.59,43.69 20.07,45.21 CON2.10
  Top 0.305: IC2.57 30.43,30.43 30.23,30.23 23.88,30.23 22.86,31.24 R11.1 C23.1
IF_SWCLK
  Top 0.152: 29.97,43.05 29.97,48.01 28.96,49.02 CON2.4 17.53,49.02 | 29.97,43.05 29.97,31.5 30.54,30.93 IC2.56 | R7.1 29.97,43.05
IF_SWDIO
  Top 0.152: IC2.55 30.8,31.43 30.48,31.75 30.48,34.04 30.82,34.38 R6.1 31.75,40.39 32.39,41.02 32.39,48.77 30.86,50.29 CON2.2
LED_COM_GREEN
  Top 0.152: IC2.85 38.38,18.14 38.61,17.91 42.8,17.91 43.94,16.76 43.94,12.19 42.93,11.18 39.88,11.18 38.61,9.91 38.61,7.62 39.37,6.86 LED2.C
LED_DAP_BLUE
  Top 0.152: IC2.84 37.88,17.88 38.36,17.4 42.42,17.4 43.18,16.64 43.18,13.21 41.91,11.94 27.94,11.94 25.4,9.4 25.4,7.87 26.42,6.86 LED1.C
LED_PWR_RED
  Top 0.152: IC2.86 38.86,19.68 38.86,18.54 39.12,18.29 43.18,18.29 44.71,16.76 44.71,8.38 46.23,6.86 LED3.C
MX7_NOBAT
  Top 0.203: CON11.5 105.59,37.26 106.01,37.68 R19.2
MX7_ONOFF  (via drill 0.25)
  Top 0.152: CON11.9 105.12,38.06 105.92,38.86 109.48,38.86 110.24,38.1 v110.24,28.57 | SW3.P$4 111.7,12.13 112.14,12.57 112.14,21.72 v110.87,22.99
  Top 0.406: SW3.P$4 SW3.P$3 99.85,12.13 C24.1
  Bottom 0.152: v110.87,22.99 110.24,23.62 v110.24,28.57
N$1
  Top 0.152: C12.1 Q1.P$1 26.16,21.08 27.18,21.08 28.03,21.93 IC2.74
N$2
  Top 0.152: 26.75,18.03 C15.1 Q1.P$3 27.87,19.99 29.31,21.43 IC2.75
N$3
  Top 0.152: IC2.47 35.38,36.25 35.31,36.32 34.04,36.32 33.78,36.58 C20.1
N$4  (via drill 0.41)
  Top 0.152: IC2.51 v32.13,35.43 | v23.5,37.21 22.61,37.21 21.93,36.54 R8.1
  Bottom 0.152: v32.13,35.43 30.36,37.21 v23.5,37.21
N$5
  Top 0.152: IC2.43 37.38,36.11 37.59,36.32 37.85,36.32 38.1,36.58 R10.2
N$6
  Top 0.152: R4.2 42,6.96 LED2.A
N$7
  Top 0.203: SW4.P$3 102.68,3.17 102.24,3.17
  Top 0.406: SW4.P$4 SW4.P$3 102.3,3.24 102.24,3.3 102.24,3.17 R17.1
N$8
  Top 0.152: IC2.78 34.88,17.61 34.8,17.53 33.53,17.53 33.28,17.27 R9.2 C22.1
N$9
  Top 0.152: R3.2 29.05,6.96 LED1.A
N$10
  Top 0.152: SW5.P$1 63.94,43.03 R23.1
N$11
  Top 0.152: R13.1 50.04,34.29 49.79,34.04 49.79,32.77 49.45,32.43 IC2.23 46.15,32.43 45.98,32.26 45.98,28.19 46.23,27.94 IC2.14
N$12
  Top 0.152: IC2.17 48.8,29.43 49.79,28.45 R14.1
N$13
  Top 0.152: R5.2 54.95,6.96 LED3.A
N$14
  Top 0.305: IC2.30 43.88,36.77 44.71,37.59 R12.2
N$15
  Top 0.152: CON11.36 98.6,43.26 TP3.TP
N$16
  Top 0.152: CON11.22 94.93,40.46 TP7.TP
N$17
  Top 0.152: CON11.30 96.88,42.06 TP5.TP
N$18
  Top 0.152: CON11.34 97.99,42.86 TP4.TP
N$19
  Top 0.152: TP11.TP 104.13,39.26 CON11.15
N$20
  Top 0.406: R15.2 SW2.1
N$21
  Top 0.406: R16.2 SW2.2
N$23
  Top 0.152: CON11.31 105.33,42.46 TP9.TP
N$24
  Top 0.152: CON11.35 103.46,43.26 103.76,43.56 TP8.TP
N$25
  Top 0.152: CON10.5 75.74,40.08 TP18.TP
N$26
  Top 0.152: CON10.7 75.25,39.68 TP17.TP
N$27
  Top 0.152: CON10.21 74.61,36.88 TP16.TP
N$28
  Top 0.152: CON10.27 73.15,35.68 72.01,34.54 TP15.TP
N$29
  Top 0.152: CON10.29 73.26,35.28 72.27,34.29 TP14.TP
N$30
  Top 0.152: TP13.TP 74.75,34.48 CON10.33
N$31
  Top 0.152: TP12.TP 75.23,34.08 CON10.35
N$32
  Top 0.152: CON10.34 81.22,34.48 TP25.TP
N$33
  Top 0.152: CON10.32 81.83,34.88 TP24.TP
N$35
  Top 0.152: CON10.18 82.08,37.68 TP22.TP
N$36
  Top 0.152: CON10.10 81.7,39.28 TP21.TP
N$37
  Top 0.152: CON10.8 81.22,39.68 TP20.TP
N$38
  Top 0.152: CON10.6 80.73,40.08 TP19.TP
PERI_3V15
  Top 0.152: CON10.3 77.7,40.48 77.85,40.64 | CON10.4 78.01,40.48 77.85,40.64 | CON10.2 78.12,40.88 77.85,41.15 | 77.85,41.15 77.85,41.78 77.47,42.16 67.69,42.16 66.8,43.05 R23.2 | 77.85,40.64 77.85,41.15 | CON10.1 77.59,40.88 77.85,41.15
PMIC_PWR
  Top 0.152: CON11.38 100.68,43.66 100.71,43.69 100.74,43.66 CON11.37 | CON11.40 100.71,44.07 101.88,44.07 CON11.39
  Top 0.406: TP10.TP 96.65,47.12 98.81,44.96 100.46,44.96 100.71,44.7 100.71,44.07 100.71,43.69
PMIC_PWRON  (via drill 0.25)
  Top 0.152: CON11.25 112.16,41.26 113.16,40.26 113.16,26.67 v112.78,26.29 | v113.16,18.54 113.16,1.78 112.52,1.14 98.81,1.14 98.05,1.91 98.05,3.14 R17.2
  Top 0.406: R17.2 C25.1 R18.1
  Bottom 0.152: v112.78,26.29 112.78,18.92 v113.16,18.54
POR_B  (via drill 0.25)
  Top 0.152: CON11.7 105.23,37.66 106.05,38.48 108.71,38.48 109.1,38.1 v109.1,29.59 | R21.2 104.82,22.39 v106.17,23.75
  Top 0.203: R18.2 99.79,8.93 99.06,9.65 94.74,9.65 93.98,10.41 93.98,18.29 94.87,19.18 98.68,19.18 99.44,19.94 R21.2
  Bottom 0.152: v106.17,23.75 106.17,26.67 v109.1,29.59
SPI3_MISO  (via drill 0.25)
  Top 0.152: CON10.19 73.99,37.28 73.15,36.45 71.88,36.45 71.12,35.69 v62.74,35.69
  Bottom 0.152: BRD1.27 61.72,36.7 v62.74,35.69
SPI3_MOSI  (via drill 0.25)
  Top 0.152: CON10.16 84.95,38.08 85.98,39.12 v85.98,40.01
  Bottom 0.152: BRD1.26 64.26,49.15 69.22,44.2 80.9,44.2 85.09,40.01 v85.98,40.01
SPI3_SCK  (via drill 0.25)
  Top 0.152: CON10.15 71.49,38.08 70.23,36.83 v66.8,36.83
  Bottom 0.152: BRD1.28 59.18,37.59 62.11,34.67 64.65,34.67 v66.8,36.83
SPI3_SS  (via drill 0.25)
  Top 0.152: CON10.14 83.95,38.48 84.58,39.12 v84.58,41.66
  Bottom 0.152: BRD1.25 66.8,47.5 69.34,44.96 81.28,44.96 v84.58,41.66
SW2_1V8  (via drill 0.25)
  Top 0.152: CON10.37 75.47,33.68 75.31,33.53 75.31,33.15 | 75.31,33.15 75.31,32.51 | CON10.39 75.45,33.28 75.31,33.15 | CON10.38 78.14,33.68 78.11,33.66 78.11,33.27 | 78.11,33.27 78.11,32.51 v78.11,28.83 | CON10.40 78.12,33.28 78.11,33.27 | v78.11,22.99 81.19,22.99 81.32,23.11
  Top 0.406: R16.1 81.32,23.11 R15.1
  Top 0.61: 78.11,32.51 75.31,32.51
  Bottom 0.152: v78.11,28.83 v78.11,22.99
TGT_NRST  (via drill 0.25)
  Top 0.152: IC2.29 44.38,36.25 44.71,36.58 47.37,36.58 | 47.37,36.58 48.14,36.58 49.02,37.46 49.02,45.97 49.91,46.86 78.62,46.86 v79,46.48 | R12.1 47.37,37.55 47.37,36.58 | v98.94,46.48 112.4,46.48 114.05,44.83 114.05,25.4 113.67,25.02 SW1.P$2
  Top 0.406: SW1.P$2 SW1.P$1 99.7,25.02 99.44,24.77 R21.1 R20.1
  Bottom 0.152: v79,46.48 v98.94,46.48
TGT_RXD_A7  (via drill 0.25)
  Top 0.152: IC2.41 38.38,36.22 38.61,36.45 38.99,36.45 39.12,36.58 39.12,42.67 44.58,48.13 81.41,48.13 v84.71,44.83 | CON11.10 93.39,38.06 v92.71,38.73
  Bottom 0.152: v92.71,38.73 89.79,38.73 84.71,43.81 v84.71,44.83
TGT_RXD_LINUX  (via drill 0.25)
  Top 0.152: IC2.19 48.69,30.43 49.41,29.72 v54.23,29.72 | v83.06,39.37 82.53,38.88 CON10.12
  Bottom 0.152: v54.23,29.72 58.68,29.72 59.82,30.86 81.28,30.86 83.06,32.64 v83.06,39.37
TGT_SWCLK  (via drill 0.41)
  Top 0.152: IC2.5 59.76,23.43 v60.45,24.13 | R13.2 59.18,34.29 60.45,33.02 v60.45,29.34 62.74,27.05 80.01,27.05 87.51,34.54 87.51,40.26 88.65,41.4 90.17,41.4 91.92,39.66 CON11.18
  Bottom 0.152: v60.45,24.13 v60.45,29.34
TGT_SWDIO  (via drill 0.41)
  Top 0.152: IC2.12 52.08,26.93 52.58,27.43 52.58,28.23 R14.2 57.15,28.45 59.82,25.78 80.77,25.78 89.03,34.04 89.03,38.23 v90.68,39.88 | CON11.17 105.32,39.66 105.92,40.26 v107.95,40.26
  Bottom 0.152: v90.68,39.88 91.32,39.88 91.57,39.62 105.29,39.62 105.92,40.26 v107.95,40.26
TGT_SWO  (via drill 0.25)
  Top 0.152: v89.16,40.51 88.27,39.62 88.27,34.29 80.39,26.42 61.47,26.42 56.45,31.43 IC2.21 | CON11.19 104.32,40.06 v104.9,40.64
  Bottom 0.152: v104.9,40.64 104.27,40.01 91.95,40.01 91.44,40.51 v89.16,40.51
TGT_TXD_A7  (via drill 0.25)
  Top 0.152: IC2.40 38.88,35.96 38.99,36.07 41.02,36.07 41.28,36.32 41.28,43.94 44.83,47.5 80.39,47.5 v82.81,45.09 | CON11.8 91.5,37.66 v91.06,38.1
  Bottom 0.152: v91.06,38.1 89.66,38.1 v82.81,45.09
TGT_TXD_LINUX  (via drill 0.25)
  Top 0.152: IC2.20 55.05,30.93 v55.5,30.48 | v70.23,40.39 72.77,40.39 74.28,38.88 CON10.11
  Bottom 0.152: v55.5,30.48 58.3,30.48 59.95,32.13 68.58,32.13 69.34,32.89 69.34,39.5 v70.23,40.39
TRST_B
  Top 0.152: CON11.11 104.76,38.46 105.67,39.37 109.98,39.37 111.25,38.1
  Top 0.203: R20.2 96.48,22.39 96.01,22.86 96.01,25.27 96.52,25.78 99.32,25.78 100.21,26.67 110.49,26.67 111.25,27.43 111.25,38.1
UART5_RXD  (via drill 0.25)
  Top 0.152: v103.76,40.64 103.25,40.64 103.03,40.86 CON11.23
  Bottom 0.152: BRD1.15 102.36,51.31 103.76,49.91 v103.76,40.64
UART5_TXD
  Top 0.152: CON11.24 95.67,40.86 91.19,45.34 BRD1.16
USER_PB1
  Top 0.152: CON10.9 74.51,39.28 72.77,41.02 68.46,41.02 68.14,40.71 SW5.P$2
VBAT
  Top 0.203: R19.1 106.01,35.98 105.53,36.46 CON11.1 100.72,36.46 arc90 100.71,36.45 arc90 100.7,36.46 CON11.2 | CON11.4 100.68,36.86 arc-90 100.71,36.83 arc-90 100.74,36.86 CON11.3 | CON11.6 100.67,37.26 arc-90 100.71,37.21
  Top 0.406: 100.71,35.94 100.71,36.45 100.71,36.83 100.71,37.21
  Top 0.813: R22.2 TP6.TP 100.71,35.94
VBUS_IF
  Top 0.406: 9.58,34.54 IC1.3 7.09,34.52 6.35,33.78 6.35,29.72 5.87,29.24 CON1.VBUS

### Text on the board
Top: cjs
tPlace: GND | +3.3v | DAP | COM | PWR
tNames: mbed iMX WARP v1.0
TopSilkscreen: SAM3U / Debug | User PB1 | BOOT0 | TARGET / nRESET | BOOT1 | Boot mode | 1 | 0 | Fuses | 0 | 0 | Manufacture | 0 | 1 | MX7 / ON/OFF | Internal Boot | 1 | 0 | Test Mode | 1 | 1 | PMIC_PWR / ON